# Altium schematic sheet TVCPCB.SchDoc
size A; SheetNumber: 1; SheetTotal: 1
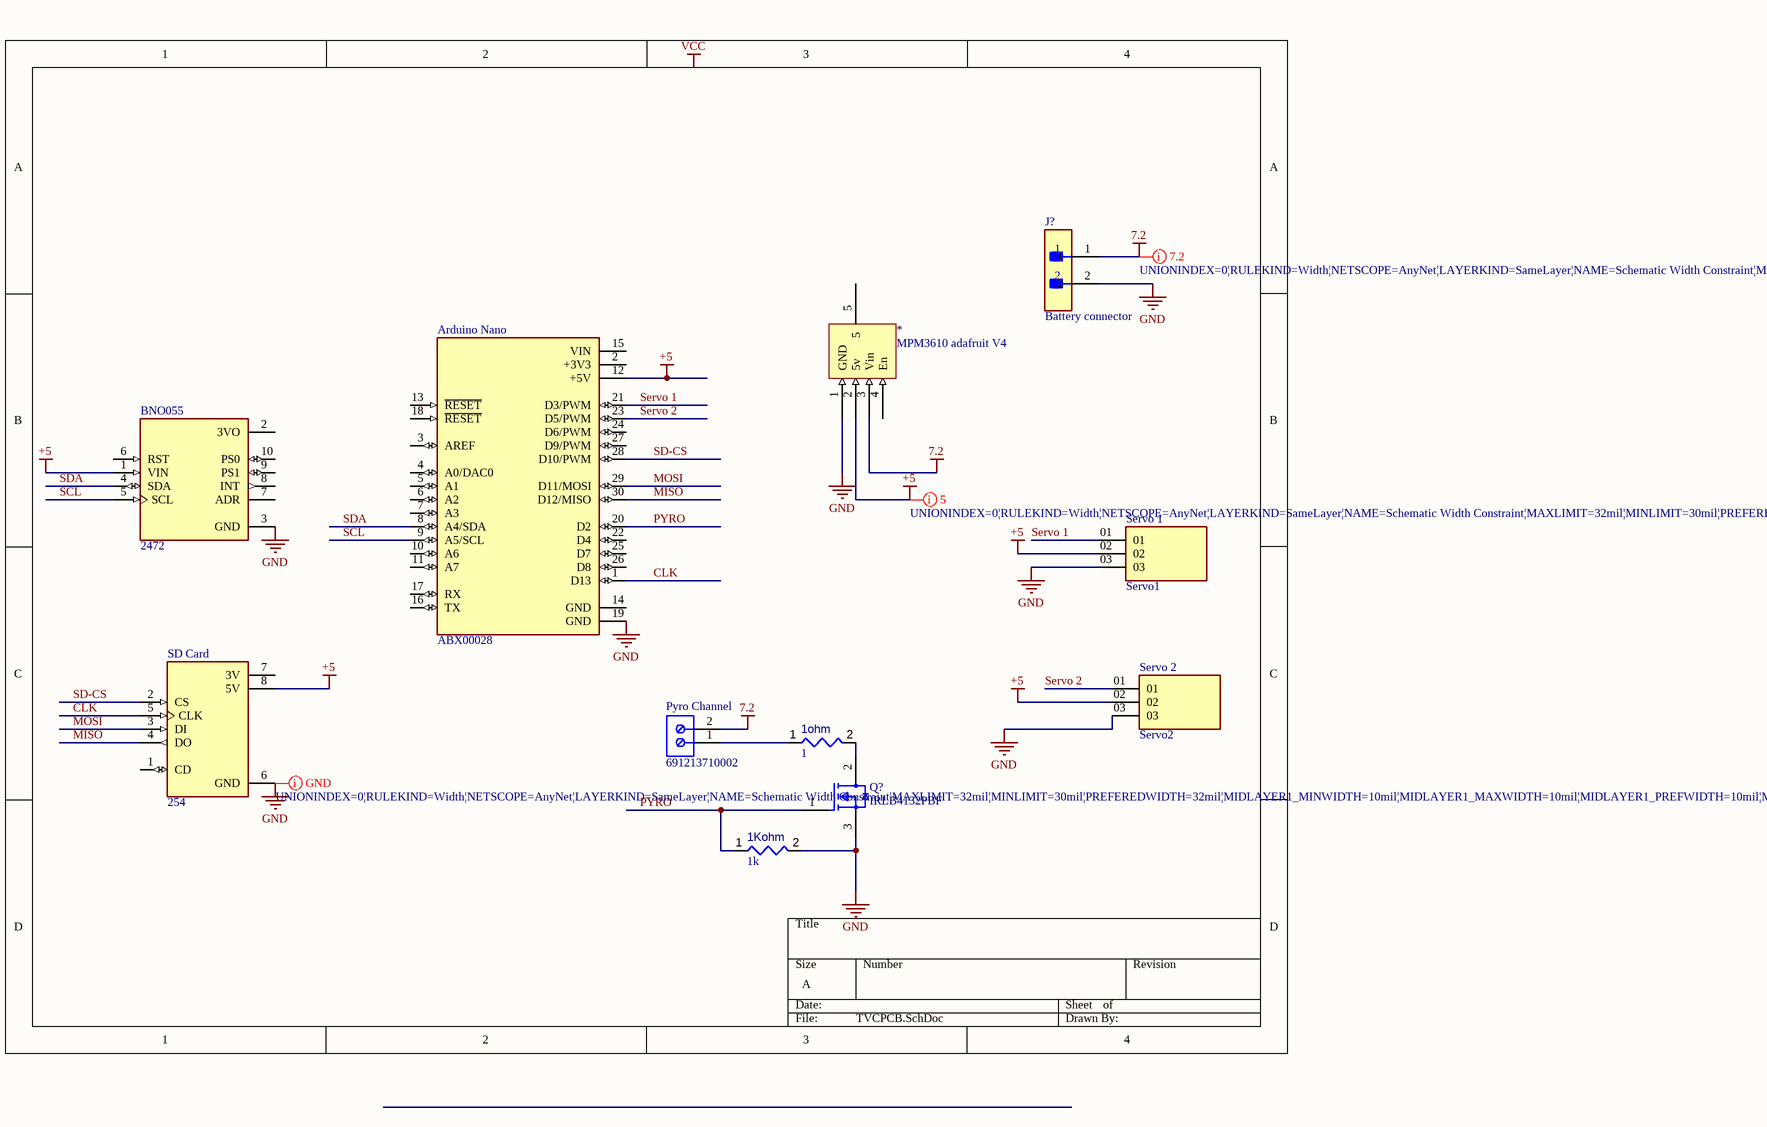
[diagram p0: TVCPCB.SchDoc]

## Parts
1Kohm  value 1k  [RESA60-630X240]  (hidden comment: MFR-25FBF52-100R)
1ohm  value 1  [RESA60-630X240]  (hidden comment: MFR-25FBF52-100R)
*  MPM3610 adafruit V4  [V4BuckConverter-Footprint-1]
Arduino_Nano  ABX00028  [MODULE_ABX00028]
BNO055  2472  [MODULE_2472]
J?  Battery connector  [FP-B2B-EH-A_LF_SN-MFG]
Pyro_Channel  691213710002  [691213710002]
Q?  IRLB4132PBF  [FP-PG-TO220-3-MFG]
SD_Card  254  [MODULE_254]
Servo_1  Servo1  [SAMTEC_TSW-203-16-T-S]
Servo_2  Servo2  [SAMTEC_TSW-203-16-T-S]

## Nets
7.2: *.3(Vin) J?.1 Pyro_Channel.2
+5: *.2(5v) Arduino_Nano.12(+5V) BNO055.1(VIN) SD_Card.8(5V) Servo_1.02 Servo_2.02
GND: 1Kohm.2 *.1(GND) Arduino_Nano.19(GND) BNO055.3(GND) J?.2 Q?.3(S) SD_Card.6(GND) Servo_1.03 Servo_2.03
CLK: Arduino_Nano.1(D13) SD_Card.5(CLK)
MISO: Arduino_Nano.30(D12/MISO) SD_Card.4(DO)
MOSI: Arduino_Nano.29(D11/MOSI) SD_Card.3(DI)
PYRO: 1Kohm.1 Arduino_Nano.20(D2) Q?.1(G)
SCL: Arduino_Nano.9(A5/SCL) BNO055.5(SCL)
SD-CS: Arduino_Nano.28(D10/PWM) SD_Card.2(CS)
SDA: Arduino_Nano.8(A4/SDA) BNO055.4(SDA)
Servo 1: Arduino_Nano.21(D3/PWM) Servo_1.01
Servo 2: Arduino_Nano.23(D5/PWM) Servo_2.01
Net1ohm_1: 1ohm.1 Pyro_Channel.1
Net1ohm_2: 1ohm.2 Q?.2(D)

Not connected (* = marked no-connect by the designer): * 4(En) 5; Arduino_Nano 2(+3V3) 3(AREF) 4(A0/DAC0) 5(A1) 6(A2) 7(A3) 10(A6) 11(A7) 13(~{RESET}) 14(GND) 15(VIN) 16(TX) 17(RX) 18(~{RESET}) 22(D4) 24(D6/PWM) 25(D7) 26(D8) 27(D9/PWM); BNO055 2(3VO) 6(RST) 7(ADR) 8(INT) 9(PS1) 10(PS0); SD_Card 1(CD) 7(3V)

## Layout directives
rule Width Constraint [Pref Width = 79mil    Min Width = 79mil    Max Width = 79mil]: 7.2
rule Width Constraint [Pref Width = 32mil    Min Width = 30mil    Max Width = 32mil]: +5, GND

## Notes on the sheet
- Labels drawn without touching a wire or pin: VCC

## Library data of the parts
1Kohm 1ohm = CMP-009-00046-4: Axial Resistor, 100 Ohm, +/- 1%, 0.25 W, -55 to 155 degC, 2-Pin THD, RoHS, Bulk; Manufacturer: Yageo; Voltage Rating: 250V; Power: 250mW; Packaging: Bulk; Max Operating Temperature: 155°C; Mounting Technology: TH; Datasheet Version: Apr-13; Case/Package: Axial; RoHS Compliant: True; Package Description: 2-Pin Axial Lead, Dia 2.4 mm, Body Length 6.3 mm; Package Quantity: 200; Package Reference: MFR-25; Tolerance: 1%; Composition: CarbonFilm; Datasheet URL: http://www.yageo.com/documents/recent/Yageo%20LR_MFR_2013.pdf; Manufacturer URL: http://www.yageo.com/; Min Operating Temperature: -55°C
* = CMP-019-00049-1: 5V buck converter; Output Current: 1.2A; Max Supply Voltage: 21V; Output Voltage: 5V; RoHS Compliant: Yes; Pins: 4
Arduino_Nano = CMP-003-000000-1: Arduinoâ€™s 5V compatible board in the smallest available form factor: 45x18mm!; MP: Arduino Nano Every; Design Item ID: ABX00028; MF: Arduino; Source: ABX00028.SchLib; Price: None; Value: *; Check_prices: https://www.snapeda.com/parts/Arduino%20Nano%20Every/Arduino/view-part/?ref=eda; Component Type: Standard; Availability: Not in stock; Pin Count: 30; SnapEDA_Link: https://www.snapeda.com/parts/Arduino%20Nano%20Every/Arduino/view-part/?ref=snap; Package: None
BNO055 = CMP-005-000000-1: Adafruit 9-DOF Absolute Orientation IMU Fusion Breakout - BNO055; Source: 2472.SchLib; Pin Count: 10; MP: 2472; SnapEDA_Link: https://www.snapeda.com/parts/2472/Adafruit+Industries/view-part/?ref=snap; Design Item ID: 2472; Value: *; Component Type: Standard; MF: Adafruit; Check_prices: https://www.snapeda.com/parts/2472/Adafruit+Industries/view-part/?ref=eda; Package: Non-Standard Adafruit
J? = CMP-17439-000026-1: CONN HEADER VERT 2POS 2.5MM; Number of Contacts: 2; Current Rating: 3A; Connector Type: Plug; Contact Resistance: 20mR; Gender: Male; Voltage Rating: 250V; Fastening Type: Detent; Depth: 3.8mm; Max Operating Temperature: 85°C; Orientation: Straight; Series: EH; Contact Plating: Tin; Min Operating Temperature: -25°C; Contact Type: Male Pin; Housing Color: White; Termination: Press-Fit; Housing Material: Nylon; Pitch: 2.5mm; Number of Positions: 2; Max Current Rating: 3A; Packaging: Bulk; Lead Free: Lead Free; Number of Rows: 1; Length: 7.5mm; Contact Mating Length: 0.13inch; Color: Natural; Max Voltage Rating (AC): 250V; Contact Material: Copper Alloy; Mount: Through Hole
Pyro_Channel = CMP-1502-02526-2: NexarPartId: 8917718; Number of Contacts: 2; Current Rating: 10A; Stripping Length: -7mm; Wire Gauge (Max): 26AWG; Plating: Brass, Steel; Wire Gauge (Min): 16AWG; Voltage: 300V; Number of Levels: 1; Pitch: 5.0038mm; Color: Green; Number of Pins: 2; Housing Material: Nylon; Termination: Screw; Max Operating Temperature: 105°C; Min Operating Temperature: -40°C; Packaging: Box; Current: 10A; REACH SVHC: Unknown; Width: 10.6mm; RoHS: Compliant; Mount: Through Hole; Height: 10mm; Contact Material: Brass; Length: 8.3mm; Lead Pitch: 5mm; Wire/Cable Gauge: 26AWG; Voltage Rating: 300V; Number of Positions Per Level: 2; Contact Plating: Tin
Q? = CMP-32901-000019-2: MOSFET N-CH 30V 78A TO220; Input Capacitance: 5.11nF; Max Power Dissipation: 140W; Rds On Max: 3.5mR; Case/Package: TO-220-3; Max Operating Temperature: 175°C; Lead Free: Lead Free; Min Operating Temperature: -55°C; Packaging: Rail/Tube; Continuous Drain Current (ID): 78A; Mount: Through Hole; Drain to Source Voltage (Vdss): 30V
SD_Card = CMP-007-000000-1: MicroSD card breakout board+; MF: Keystone Electronics; Design Item ID: 254; Component Type: Standard; Source: 254.SchLib; Check_prices: https://www.snapeda.com/parts/254/Adafruit+Industries/view-part/?ref=eda; MP: 254; Value: *; Pin Count: 8; Availability: In Stock; SnapEDA_Link: https://www.snapeda.com/parts/254/Adafruit+Industries/view-part/?ref=snap; Package: Keystone Electronics; Price: None; Purchase-URL: https://pricing.snapeda.com/search/part/254/?ref=eda
Servo_1 Servo_2 = CMP-013-000000-2: Source: TSW-203-16-T-S.SchLib; Price: None; Component Type: Standard; Pin Count: 3; Value: *; Package: None; Availability: Unavailable; MP: TSW-203-16-T-S; Design Item ID: TSW-203-16-T-S